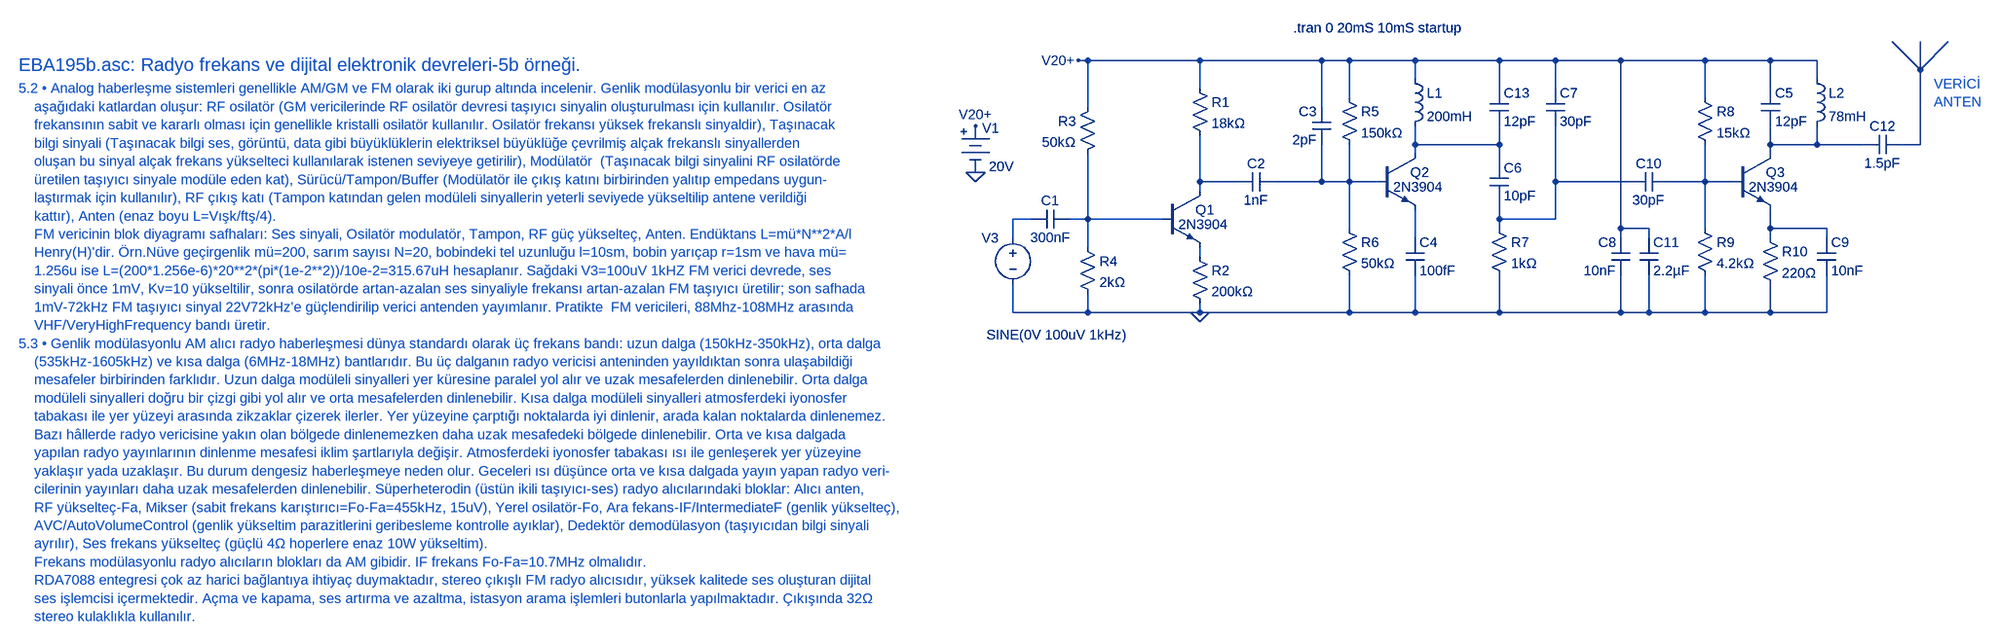
[diagram p0: schematic EBA195b.asc]
EBA195b.asc, the LTspice schematic file:
Version 4
SHEET 1 7064 4332
WIRE 1792 48 1776 48
WIRE 1984 48 1792 48
WIRE 2192 48 1984 48
WIRE 2240 48 2192 48
WIRE 2352 48 2240 48
WIRE 2496 48 2352 48
WIRE 2592 48 2496 48
WIRE 2704 48 2592 48
WIRE 2848 48 2704 48
WIRE 2960 48 2848 48
WIRE 3040 48 2960 48
WIRE 3216 64 3168 16
WIRE 3216 64 3216 16
WIRE 3216 64 3264 16
WIRE 2352 80 2352 48
WIRE 3040 80 3040 48
WIRE 1984 96 1984 48
WIRE 2496 96 2496 48
WIRE 2592 96 2592 48
WIRE 2960 96 2960 48
WIRE 2240 112 2240 48
WIRE 2848 112 2848 48
WIRE 1792 128 1792 48
WIRE 2192 128 2192 48
WIRE 2352 192 2352 160
WIRE 2496 192 2496 160
WIRE 2496 192 2352 192
WIRE 2960 192 2960 160
WIRE 3040 192 3040 160
WIRE 3040 192 2960 192
WIRE 3120 192 3040 192
WIRE 3216 192 3216 64
WIRE 3216 192 3184 192
WIRE 2352 208 2352 192
WIRE 2960 208 2960 192
WIRE 2496 224 2496 192
WIRE 1984 256 1984 176
WIRE 2048 256 1984 256
WIRE 2192 256 2192 192
WIRE 2192 256 2112 256
WIRE 2240 256 2240 192
WIRE 2240 256 2192 256
WIRE 2288 256 2240 256
WIRE 2592 256 2592 160
WIRE 2720 256 2592 256
WIRE 2848 256 2848 192
WIRE 2848 256 2784 256
WIRE 2896 256 2848 256
WIRE 1984 272 1984 256
WIRE 1696 320 1664 320
WIRE 1792 320 1792 208
WIRE 1792 320 1760 320
WIRE 1920 320 1792 320
WIRE 2496 320 2496 288
WIRE 2592 320 2592 256
WIRE 2592 320 2496 320
WIRE 2240 336 2240 256
WIRE 2496 336 2496 320
WIRE 2704 336 2704 48
WIRE 2752 336 2704 336
WIRE 2848 336 2848 256
WIRE 2960 336 2960 304
WIRE 3056 336 2960 336
WIRE 1664 352 1664 320
WIRE 2352 352 2352 304
WIRE 2704 352 2704 336
WIRE 2752 352 2752 336
WIRE 2960 352 2960 336
WIRE 3056 352 3056 336
WIRE 1792 368 1792 320
WIRE 1984 384 1984 368
WIRE 1664 480 1664 432
WIRE 1792 480 1792 448
WIRE 1792 480 1664 480
WIRE 1984 480 1984 464
WIRE 1984 480 1792 480
WIRE 2240 480 2240 416
WIRE 2240 480 1984 480
WIRE 2352 480 2352 416
WIRE 2352 480 2240 480
WIRE 2496 480 2496 416
WIRE 2496 480 2352 480
WIRE 2704 480 2704 416
WIRE 2704 480 2496 480
WIRE 2752 480 2752 416
WIRE 2752 480 2704 480
WIRE 2848 480 2848 416
WIRE 2848 480 2752 480
WIRE 2960 480 2960 432
WIRE 2960 480 2848 480
WIRE 3056 480 3056 416
WIRE 3056 480 2960 480
FLAG 1600 240 0
FLAG 1600 160 V20+
FLAG 1776 48 V20+
FLAG 1984 480 0
SYMBOL Misc\\battery 1600 144 R0
WINDOW 0 11 20 Left 2
WINDOW 3 23 86 Left 2
SYMATTR InstName V1
SYMATTR Value 20V
SYMBOL npn 1920 272 R0
WINDOW 3 27 57 Left 2
SYMATTR Value 2N3904
SYMATTR InstName Q1
SYMBOL res 1968 80 R0
SYMATTR InstName R1
SYMATTR Value 18kΩ
SYMBOL res 1968 368 R0
SYMATTR InstName R2
SYMATTR Value 200kΩ
SYMBOL res 1808 112 M0
SYMATTR InstName R3
SYMATTR Value 50kΩ
SYMBOL res 1776 352 R0
SYMATTR InstName R4
SYMATTR Value 2kΩ
SYMBOL cap 1760 304 R90
WINDOW 0 0 32 VBottom 2
WINDOW 3 32 32 VTop 2
SYMATTR InstName C1
SYMATTR Value 300nF
SYMBOL voltage 1664 336 M0
WINDOW 3 -194 182 Left 2
WINDOW 123 0 0 Left 0
WINDOW 39 0 0 Left 0
SYMATTR Value SINE(0V 100uV 1kHz)
SYMATTR InstName V3
SYMBOL cap 2112 240 R90
WINDOW 0 0 32 VBottom 2
WINDOW 3 32 32 VTop 2
SYMATTR InstName C2
SYMATTR Value 1nF
SYMBOL npn 2288 208 R0
WINDOW 3 27 57 Left 2
SYMATTR Value 2N3904
SYMATTR InstName Q2
SYMBOL res 2224 96 R0
SYMATTR InstName R5
SYMATTR Value 150kΩ
SYMBOL res 2224 320 R0
SYMATTR InstName R6
SYMATTR Value 50kΩ
SYMBOL cap 2208 128 M0
SYMATTR InstName C3
SYMATTR Value 2pF
SYMBOL ind 2336 64 R0
SYMATTR InstName L1
SYMATTR Value 200mH
SYMBOL cap 2336 352 R0
SYMATTR InstName C4
SYMATTR Value 100fF
SYMBOL cap 2944 96 R0
SYMATTR InstName C5
SYMATTR Value 12pF
SYMBOL cap 2480 224 R0
SYMATTR InstName C6
SYMATTR Value 10pF
SYMBOL cap 2576 96 R0
SYMATTR InstName C7
SYMATTR Value 30pF
SYMBOL res 2480 320 R0
SYMATTR InstName R7
SYMATTR Value 1kΩ
SYMBOL npn 2896 208 R0
WINDOW 3 27 57 Left 2
SYMATTR Value 2N3904
SYMATTR InstName Q3
SYMBOL res 2832 96 R0
SYMATTR InstName R8
SYMATTR Value 15kΩ
SYMBOL res 2832 320 R0
SYMATTR InstName R9
SYMATTR Value 4.2kΩ
SYMBOL cap 2720 352 M0
SYMATTR InstName C8
SYMATTR Value 10nF
SYMBOL ind 3024 64 R0
SYMATTR InstName L2
SYMATTR Value 78mH
SYMBOL cap 3040 352 R0
SYMATTR InstName C9
SYMATTR Value 10nF
SYMBOL cap 2784 240 R90
WINDOW 0 0 32 VBottom 2
WINDOW 3 32 32 VTop 2
SYMATTR InstName C10
SYMATTR Value 30pF
SYMBOL cap 2736 352 R0
SYMATTR InstName C11
SYMATTR Value 2.2µF
SYMBOL res 2944 336 R0
SYMATTR InstName R10
SYMATTR Value 220Ω
SYMBOL cap 3184 176 R90
WINDOW 0 0 32 VBottom 2
WINDOW 3 32 32 VTop 2
SYMATTR InstName C12
SYMATTR Value 1.5pF
SYMBOL cap 2480 96 R0
SYMATTR InstName C13
SYMATTR Value 12pF
TEXT -232 56 Left 3 ;EBA195b.asc: Radyo frekans ve dijital elektronik devreleri-5b örneği.
TEXT -232 96 Left 2 ;5.2 • Analog haberleşme sistemleri genellikle AM/GM ve FM olarak iki gurup altında incelenir. Genlik modülasyonlu bir verici en az\n    aşağıdaki katlardan oluşur: RF osilatör (GM vericilerinde RF osilatör devresi taşıyıcı sinyalin oluşturulması için kullanılır. Osilatör \n    frekansının sabit ve kararlı olması için genellikle kristalli osilatör kullanılır. Osilatör frekansı yüksek frekanslı sinyaldir), Taşınacak \n    bilgi sinyali (Taşınacak bilgi ses, görüntü, data gibi büyüklüklerin elektriksel büyüklüğe çevrilmiş alçak frekanslı sinyallerden \n    oluşan bu sinyal alçak frekans yükselteci kullanılarak istenen seviyeye getirilir), Modülatör  (Taşınacak bilgi sinyalini RF osilatörde \n    üretilen taşıyıcı sinyale modüle eden kat), Sürücü/Tampon/Buffer (Modülatör ile çıkış katını birbirinden yalıtıp empedans uygun-\n    laştırmak için kullanılır), RF çıkış katı (Tampon katından gelen modüleli sinyallerin yeterli seviyede yükseltilip antene verildiği \n    kattır), Anten (enaz boyu L=Vışk/ftş/4).\n    FM vericinin blok diyagramı safhaları: Ses sinyali, Osilatör modulatör, Tampon, RF güç yükselteç, Anten. Endüktans L=mü*N**2*A/l \n    Henry(H)'dir. Örn.Nüve geçirgenlik mü=200, sarım sayısı N=20, bobindeki tel uzunluğu l=10sm, bobin yarıçap r=1sm ve hava mü=\n    1.256u ise L=(200*1.256e-6)*20**2*(pi*(1e-2**2))/10e-2=315.67uH hesaplanır. Sağdaki V3=100uV 1kHZ FM verici devrede, ses\n    sinyali önce 1mV, Kv=10 yükseltilir, sonra osilatörde artan-azalan ses sinyaliyle frekansı artan-azalan FM taşıyıcı üretilir; son safhada\n    1mV-72kHz FM taşıyıcı sinyal 22V72kHz'e güçlendirilip verici antenden yayımlanır. Pratikte  FM vericileri, 88Mhz-108MHz arasında \n    VHF/VeryHighFrequency bandı üretir.\n5.3 • Genlik modülasyonlu AM alıcı radyo haberleşmesi dünya standardı olarak üç frekans bandı: uzun dalga (150kHz-350kHz), orta dalga\n    (535kHz-1605kHz) ve kısa dalga (6MHz-18MHz) bantlarıdır. Bu üç dalganın radyo vericisi anteninden yayıldıktan sonra ulaşabildiği \n    mesafeler birbirinden farklıdır. Uzun dalga modüleli sinyalleri yer küresine paralel yol alır ve uzak mesafelerden dinlenebilir. Orta dalga\n    modüleli sinyalleri doğru bir çizgi gibi yol alır ve orta mesafelerden dinlenebilir. Kısa dalga modüleli sinyalleri atmosferdeki iyonosfer \n    tabakası ile yer yüzeyi arasında zikzaklar çizerek ilerler. Yer yüzeyine çarptığı noktalarda iyi dinlenir, arada kalan noktalarda dinlenemez.\n    Bazı hâllerde radyo vericisine yakın olan bölgede dinlenemezken daha uzak mesafedeki bölgede dinlenebilir. Orta ve kısa dalgada \n    yapılan radyo yayınlarının dinlenme mesafesi iklim şartlarıyla değişir. Atmosferdeki iyonosfer tabakası ısı ile genleşerek yer yüzeyine \n    yaklaşır yada uzaklaşır. Bu durum dengesiz haberleşmeye neden olur. Geceleri ısı düşünce orta ve kısa dalgada yayın yapan radyo veri-\n    cilerinin yayınları daha uzak mesafelerden dinlenebilir. Süperheterodin (üstün ikili taşıyıcı-ses) radyo alıcılarındaki bloklar: Alıcı anten,\n    RF yükselteç-Fa, Mikser (sabit frekans karıştırıcı=Fo-Fa=455kHz, 15uV), Yerel osilatör-Fo, Ara fekans-IF/IntermediateF (genlik yükselteç),\n    AVC/AutoVolumeControl (genlik yükseltim parazitlerini geribesleme kontrolle ayıklar), Dedektör demodülasyon (taşıyıcıdan bilgi sinyali \n    ayrılır), Ses frekans yükselteç (güçlü 4Ω hoperlere enaz 10W yükseltim).\n    Frekans modülasyonlu radyo alıcıların blokları da AM gibidir. IF frekans Fo-Fa=10.7MHz olmalıdır. \n    RDA7088 entegresi çok az harici bağlantıya ihtiyaç duymaktadır, stereo çıkışlı FM radyo alıcısıdır, yüksek kalitede ses oluşturan dijital\n    ses işlemcisi içermektedir. Açma ve kapama, ses artırma ve azaltma, istasyon arama işlemleri butonlarla yapılmaktadır. Çıkışında 32Ω\n    stereo kulaklıkla kullanılır.
TEXT 3240 88 Left 2 ;VERİCİ\nANTEN
TEXT 2144 -8 Left 2 !.tran 0 20mS 10mS startup

The netlist it stands for:
* EBA195b.asc
V1 V20+ 0 20V
Q1 N004 N009 N012 0 2N3904
R1 V20+ N004 18kΩ
R2 N012 0 200kΩ
R3 V20+ N009 50kΩ
R4 N009 0 2kΩ
C1 N009 N008 300nF
V3 N008 0 SINE(0V 100uV 1kHz)
C2 N005 N004 1nF
Q2 N002 N005 N011 0 2N3904
R5 V20+ N005 150kΩ
R6 N005 0 50kΩ
C3 V20+ N005 2pF
L1 V20+ N002 200mH
C4 N011 0 100fF
C5 V20+ N003 12pF
C6 N002 N006 10pF
C7 V20+ N006 30pF
R7 N006 0 1kΩ
Q3 N003 N007 N010 0 2N3904
R8 V20+ N007 15kΩ
R9 N007 0 4.2kΩ
C8 V20+ 0 10nF
L2 V20+ N003 78mH
C9 N010 0 10nF
C10 N007 N006 30pF
C11 V20+ 0 2.2µF
R10 N010 0 220Ω
C12 N001 N003 1.5pF
C13 V20+ N002 12pF
.model NPN NPN
.model PNP PNP
.lib standard.bjt
* EBA195b.asc: Radyo frekans ve dijital elektronik devreleri-5b örneği.
* 5.2 • Analog haberleşme sistemleri genellikle AM/GM ve FM olarak iki gurup altında incelenir. Genlik modülasyonlu bir verici en az
*     aşağıdaki katlardan oluşur: RF osilatör (GM vericilerinde RF osilatör devresi taşıyıcı sinyalin oluşturulması için kullanılır. Osilatör
*     frekansının sabit ve kararlı olması için genellikle kristalli osilatör kullanılır. Osilatör frekansı yüksek frekanslı sinyaldir), Taşınacak
*     bilgi sinyali (Taşınacak bilgi ses, görüntü, data gibi büyüklüklerin elektriksel büyüklüğe çevrilmiş alçak frekanslı sinyallerden
*     oluşan bu sinyal alçak frekans yükselteci kullanılarak istenen seviyeye getirilir), Modülatör  (Taşınacak bilgi sinyalini RF osilatörde
*     üretilen taşıyıcı sinyale modüle eden kat), Sürücü/Tampon/Buffer (Modülatör ile çıkış katını birbirinden yalıtıp empedans uygun-
*     laştırmak için kullanılır), RF çıkış katı (Tampon katından gelen modüleli sinyallerin yeterli seviyede yükseltilip antene verildiği
*     kattır), Anten (enaz boyu L=Vışk/ftş/4).
*     FM vericinin blok diyagramı safhaları: Ses sinyali, Osilatör modulatör, Tampon, RF güç yükselteç, Anten. Endüktans L=mü*N**2*A/l
*     Henry(H)'dir. Örn.Nüve geçirgenlik mü=200, sarım sayısı N=20, bobindeki tel uzunluğu l=10sm, bobin yarıçap r=1sm ve hava mü=
*     1.256u ise L=(200*1.256e-6)*20**2*(pi*(1e-2**2))/10e-2=315.67uH hesaplanır. Sağdaki V3=100uV 1kHZ FM verici devrede, ses
*     sinyali önce 1mV, Kv=10 yükseltilir, sonra osilatörde artan-azalan ses sinyaliyle frekansı artan-azalan FM taşıyıcı üretilir; son safhada
*     1mV-72kHz FM taşıyıcı sinyal 22V72kHz'e güçlendirilip verici antenden yayımlanır. Pratikte  FM vericileri, 88Mhz-108MHz arasında
*     VHF/VeryHighFrequency bandı üretir.
* 5.3 • Genlik modülasyonlu AM alıcı radyo haberleşmesi dünya standardı olarak üç frekans bandı: uzun dalga (150kHz-350kHz), orta dalga
*     (535kHz-1605kHz) ve kısa dalga (6MHz-18MHz) bantlarıdır. Bu üç dalganın radyo vericisi anteninden yayıldıktan sonra ulaşabildiği
*     mesafeler birbirinden farklıdır. Uzun dalga modüleli sinyalleri yer küresine paralel yol alır ve uzak mesafelerden dinlenebilir. Orta dalga
*     modüleli sinyalleri doğru bir çizgi gibi yol alır ve orta mesafelerden dinlenebilir. Kısa dalga modüleli sinyalleri atmosferdeki iyonosfer
*     tabakası ile yer yüzeyi arasında zikzaklar çizerek ilerler. Yer yüzeyine çarptığı noktalarda iyi dinlenir, arada kalan noktalarda dinlenemez.
*     Bazı hâllerde radyo vericisine yakın olan bölgede dinlenemezken daha uzak mesafedeki bölgede dinlenebilir. Orta ve kısa dalgada
*     yapılan radyo yayınlarının dinlenme mesafesi iklim şartlarıyla değişir. Atmosferdeki iyonosfer tabakası ısı ile genleşerek yer yüzeyine
*     yaklaşır yada uzaklaşır. Bu durum dengesiz haberleşmeye neden olur. Geceleri ısı düşünce orta ve kısa dalgada yayın yapan radyo veri-
*     cilerinin yayınları daha uzak mesafelerden dinlenebilir. Süperheterodin (üstün ikili taşıyıcı-ses) radyo alıcılarındaki bloklar: Alıcı anten,
*     RF yükselteç-Fa, Mikser (sabit frekans karıştırıcı=Fo-Fa=455kHz, 15uV), Yerel osilatör-Fo, Ara fekans-IF/IntermediateF (genlik yükselteç),
*     AVC/AutoVolumeControl (genlik yükseltim parazitlerini geribesleme kontrolle ayıklar), Dedektör demodülasyon (taşıyıcıdan bilgi sinyali
*     ayrılır), Ses frekans yükselteç (güçlü 4Ω hoperlere enaz 10W yükseltim).
*     Frekans modülasyonlu radyo alıcıların blokları da AM gibidir. IF frekans Fo-Fa=10.7MHz olmalıdır.
*     RDA7088 entegresi çok az harici bağlantıya ihtiyaç duymaktadır, stereo çıkışlı FM radyo alıcısıdır, yüksek kalitede ses oluşturan dijital
*     ses işlemcisi içermektedir. Açma ve kapama, ses artırma ve azaltma, istasyon arama işlemleri butonlarla yapılmaktadır. Çıkışında 32Ω
*     stereo kulaklıkla kullanılır.
* VERİCİ
* ANTEN
.tran 0 20mS 10mS startup
.backanno
.end